# EAGLE schematic PCB-for-IoT-sch (EAGLE 9.7.0)
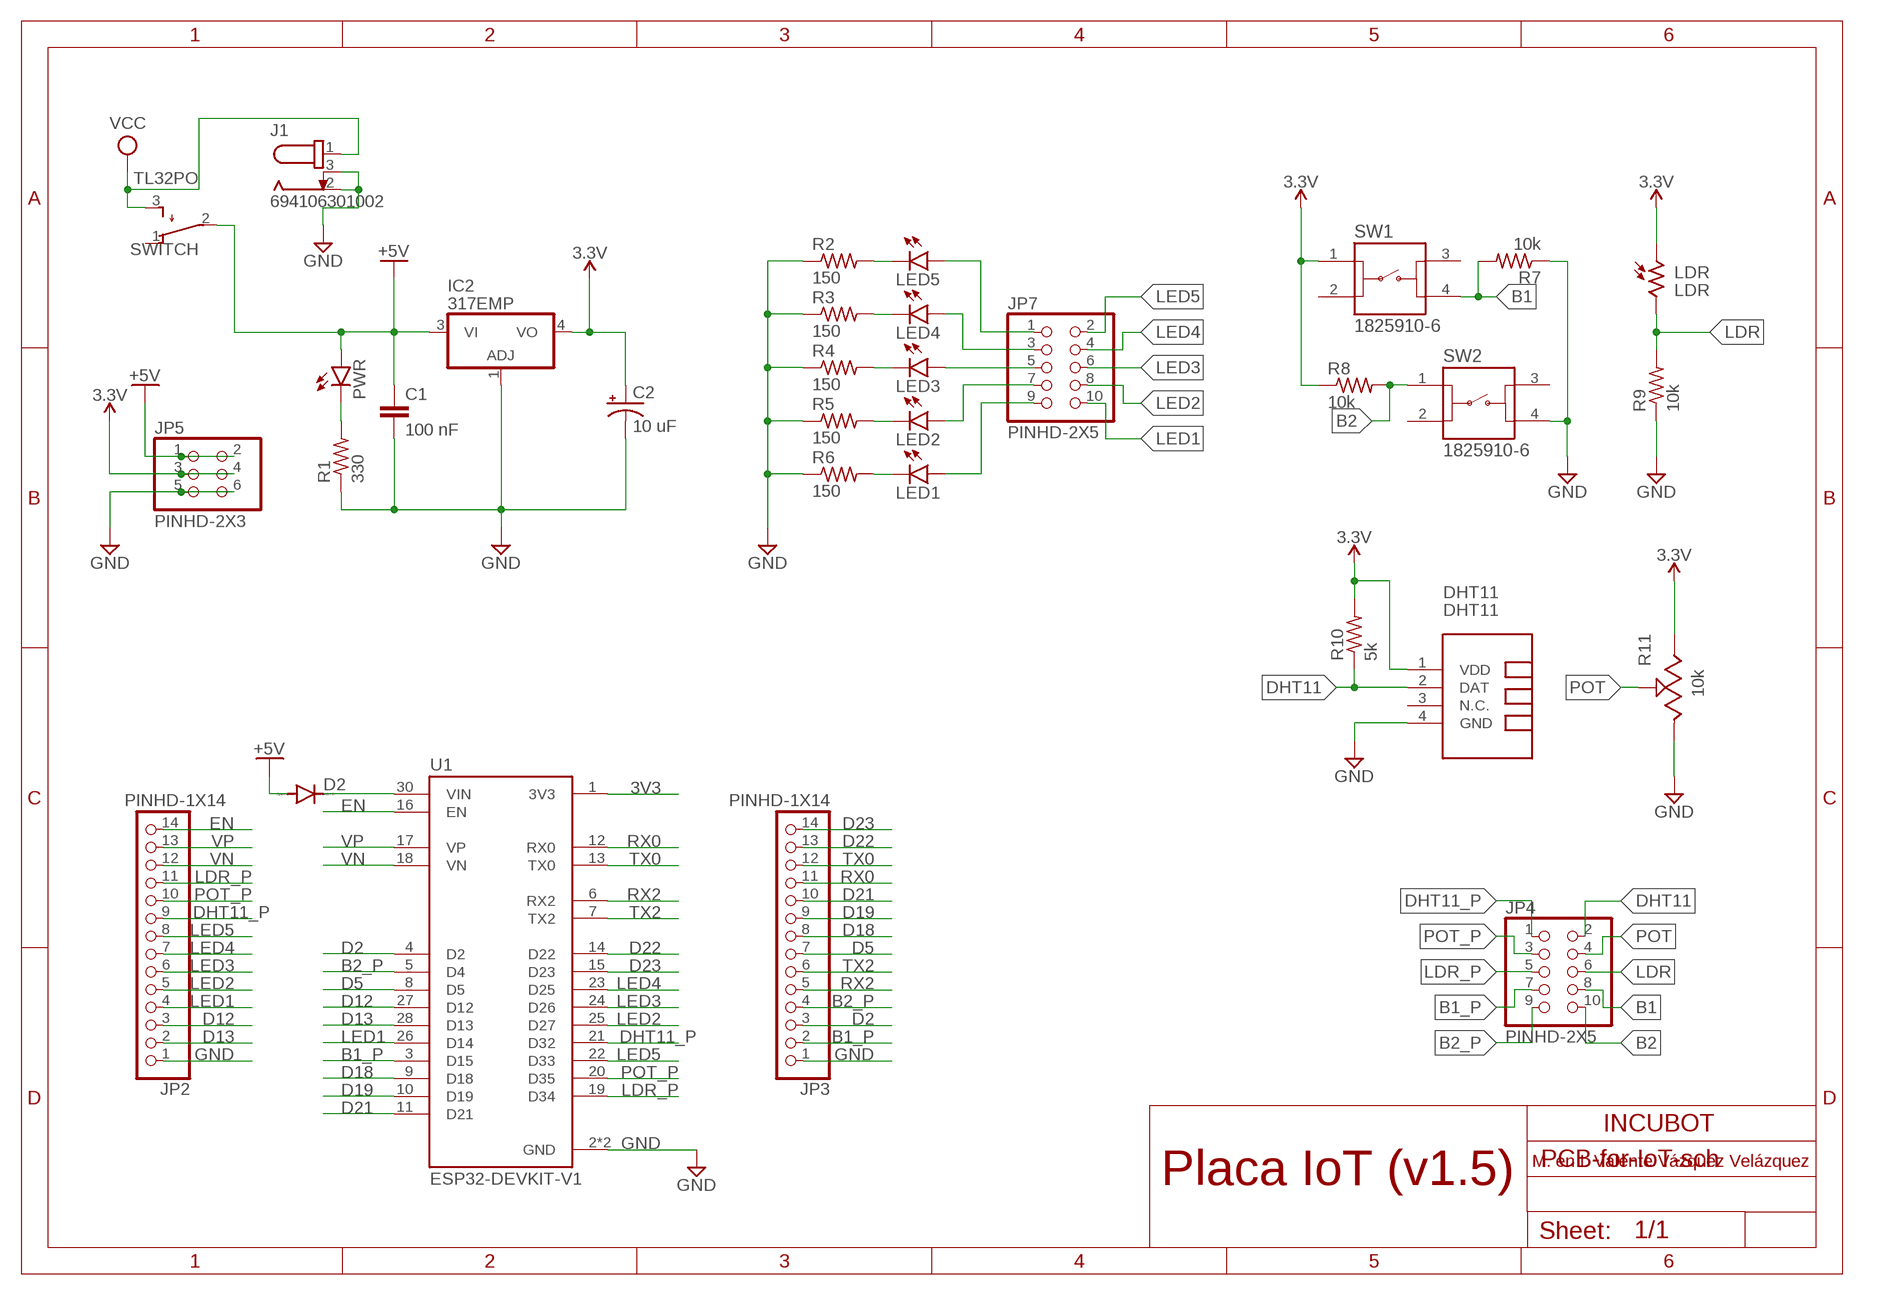
[diagram p0: schematic, sheet 1]

## Parts
C1  100 nF  C-EU050-025X075  [C050-025X075]
C2  10 uF  CPOL-USE2-4  [E2-4]
D2  1N4148DO35-7  [DO35-7]
DHT11  DHT11  TEMP-HUM-SENSOR-DHT11  [TEMP-HUM-SENSOR-DHT11]
IC2  317EMP  [SOT223]
J1  694106301002  [694106301002]
JP2  PINHD-1X14  [1X14]
JP3  PINHD-1X14  [1X14]
JP4  PINHD-2X5  [2X05]
JP5  PINHD-2X3  [2X03]
JP7  PINHD-2X5  [2X05]
LDR  LDR  NSL-19M51-TO-18_PLASTIC  [NSL_PT_TO-18_PLASTIC]
LED1  LED3MM  [LED3MM]
LED2  LED3MM  [LED3MM]
LED3  LED3MM  [LED3MM]
LED4  LED3MM  [LED3MM]
LED5  LED3MM  [LED3MM]
PWR  LED3MM  [LED3MM]
R1  330  R-US_0207/10  [0207/10]
R2  150  R-US_0207/10  [0207/10]
R3  150  R-US_0207/10  [0207/10]
R4  150  R-US_0207/10  [0207/10]
R5  150  R-US_0207/10  [0207/10]
R6  150  R-US_0207/10  [0207/10]
R7  10k  R-US_0207/10  [0207/10]
R8  10k  R-US_0207/10  [0207/10]
R9  10k  R-US_0207/10  [0207/10]
R10  5k  R-US_0207/10  [0207/10]
R11  10k  3362P-1-103LF  [3362P-1-103LF]
SW1  1825910-6  [1825910-6]
SW2  1825910-6  [1825910-6]
SWITCH  TL32PO  [TL3XPO]
U1  ESP32-DEVKIT-V1  [MODULE_ESP32_DEVKIT_V1]

## Nets
3.3V: C2.+ DHT11.1(VDD) IC2.4(VO) JP5.3 JP5.4 LDR.1 R8.1 R10.2 R11.3 SW1.1
3V3: U1.1(3V3)
+5V: C1.1 D2.A IC2.3(VI) JP5.1 JP5.2 PWR.A SWITCH.2(P)
B1: JP4.8 R7.2 SW1.4
B1_P: JP3.2 JP4.7 U1.3(D15)
B2: JP4.10 R8.2 SW2.1
B2_P: JP3.4 JP4.9 U1.5(D4)
D2: JP3.3 U1.4(D2)
D5: JP3.7 U1.8(D5)
D12: JP2.3 U1.27(D12)
D13: JP2.2 U1.28(D13)
D18: JP3.8 U1.9(D18)
D19: JP3.9 U1.10(D19)
D21: JP3.10 U1.11(D21)
D22: JP3.13 U1.14(D22)
D23: JP3.14 U1.15(D23)
DHT11: DHT11.2(DAT) JP4.2 R10.1
DHT11_P: JP2.9 JP4.1 U1.21(D32)
EN: JP2.14 U1.16(EN)
GND: C1.2 C2.- DHT11.4(GND) IC2.1(ADJ) J1.2 J1.3 JP2.1 JP3.1 JP5.5 JP5.6 R1.1 R2.1 R3.1 R4.1 R5.1 R6.1 R7.1 R9.1 R11.1 SW2.4 U1.2(GND) U1.29(GND)
LDR: JP4.6 LDR.2 R9.2
LDR_P: JP2.11 JP4.5 U1.19(D34)
LED1: JP2.4 JP7.10 U1.26(D14)
LED2: JP2.5 JP7.8 U1.25(D27)
LED3: JP2.6 JP7.6 U1.24(D26)
LED4: JP2.7 JP7.4 U1.23(D25)
LED5: JP2.8 JP7.2 U1.22(D33)
N$1: PWR.K(C) R1.2
N$2: LED5.K(C) R2.2
N$3: LED4.K(C) R3.2
N$4: LED3.K(C) R4.2
N$5: LED2.K(C) R5.2
N$6: LED1.K(C) R6.2
N$7: JP7.5 LED3.A
N$8: JP7.3 LED4.A
N$9: JP7.7 LED2.A
N$10: JP7.1 LED5.A
N$11: JP7.9 LED1.A
N$12: D2.C U1.30(VIN)
POT: JP4.4 R11.2
POT_P: JP2.10 JP4.3 U1.20(D35)
RX0: JP3.11 U1.12(RX0)
RX2: JP3.5 U1.6(RX2)
TX0: JP3.12 U1.13(TX0)
TX2: JP3.6 U1.7(TX2)
VCC: J1.1 SWITCH.3(S)
VN: JP2.12 U1.18(VN)
VP: JP2.13 U1.17(VP)
Unconnected: DHT11.3(N.C.) SW1.2 SW1.3 SW2.2 SW2.3 SWITCH.1(O)

## Notes on the sheet
- INCUBOT
- Placa IoT (v1.5)
- M. en I. Valente Vázquez Velázquez

## Library data of the parts
C1 = rcl:C-EU: CAPACITOR, European symbol; SPICEPREFIX: C
C2 = rcl:CPOL-US: POLARIZED CAPACITOR, American symbol; SPICEPREFIX: C
D2 = diode:1N4148: DIODE high speed (Philips)
DHT11 = DHT11:TEMP-HUM-SENSOR-DHT11: DHT11 - digital humidity & temperature sensor DHT11 datasheet available here: https://akizukidenshi.com/download/ds/aosong/DHT11.pdf Click here to find device on ebay.com <http://www.ebay.com/sch/dht11+digital+sensor>
IC2 = linear:*317: Positive VOLTAGE REGULATOR
J1 = DC Power Jacks:694106301002: CONN PWR JACK 2.1X5.5MM SOLDER Manufacturer's datasheet <https://katalog.we-online.de/em/datasheet/6941xx301002.pdf>; CREATED_BY: PCBLayout.com; DIGIKEY_PART_NUMBER: 732-5930-ND; MANUFACTURER: Wurth Electronics Inc.; MPN: 694106301002
JP2 JP3 = Connector:PINHD-1X14: PIN HEADER; CATEGORY: CONNECTOR; SUB-CATEGORY: PIN-HEADER
JP4 JP7 = Connector:PINHD-2X5: PIN HEADER; CATEGORY: CONNECTOR; SUB-CATEGORY: PIN-HEADER
JP5 = Connector:PINHD-2X3: PIN HEADER; CATEGORY: CONNECTOR; SUB-CATEGORY: PIN-HEADER
LDR = Sensor:NSL-*-: Hermetic Photocell Datasheet <https://media.digikey.com/pdf/Data%20Sheets/Photonic%20Detetectors%20Inc%20PDFs/NSL-5510.pdf> Datasheet <https://media.digikey.com/pdf/Data%20Sheets/Photonic%20Detetectors%20Inc%20PDFs/Hermetic%20Pkg'd%20CdS%20Product%20Overview.pdf>; CATEGORY: Sensor; DESCRIPTION: PHOTOCELL; MPN: NSL-19M51; OPERATING_TEMP: -60°C to 75°C; PART_STATUS: Active; ROHS_COMPLIANT: Non-Compliant; SERIES: -; SUB-CATEGORY: Photocell; VALUE: NSL-19M51
LED1-LED5 PWR = led:LED: LED OSRAM: - CHIPLED LG R971, LG N971, LY N971, LG Q971, LY Q971, LO R971, LY R971 LH N974, LH R974 LS Q976, LO Q976, LY Q976 LO Q996 - Hyper CHIPLED LW Q18S LB Q993, LB Q99A, LB R99A - SideLED LS A670, LO A670, LY A670, LG A670, LP A670 LB A673, LV A673, LT A673, LW A673 LH A674 LY A675 LS A676, LA A676, LO A676, LY A676, LW A676 LS A679, LY A679, LG A679 - Hyper Micro SIDELED® LS Y876, LA Y876, LO Y876, LY Y876 LT Y87S - SmartLED LW L88C, LW L88S LB L89C, LB L89S, LG L890 LS L89K, LO L89K, LY L89K LS L896, LA L896, LO L896, LY L896 - TOPLED LS T670, LO T670, LY T670, LG T670, LP T670 LSG T670, LSP T670, LSY T670, LOP T670, LYG T670 LG T671, LOG T671, LSG T671 LB T673, LV T673, LT T673, LW T673 LH T674 LS T676, LA T676, LO T676, LY T676, LB T676, LH T676, LSB T676, LW T676 LB T67C, LV T67C, LT T67C, LS T67K, LO T67K, LY T67K, LW E67C LS E67B, LA E67B, LO E67B, LY E67B, LB E67C, LV E67C, LT E67C LW T67C LS T679, LY T679, LG T679 LS T770, LO T770, LY T770, LG T770, LP T770 LB T773, LV T773, LT T773, LW T773 LH T774 LS E675, LA E675, LY E675, LS T675 LS T776, LA T776, LO T776, LY T776, LB T776 LHGB T686 LT T68C, LB T68C - Hyper Mini TOPLED® LB M676 - Mini TOPLED Santana® LG M470 LS M47K, LO M47K, LY M47K Source: http://www.osram.convergy.de LUXEON: - LUMILED® LXK2-PW12-R00, LXK2-PW12-S00, LXK2-PW14-U00, LXK2-PW14-V00 LXK2-PM12-R00, LXK2-PM12-S00, LXK2-PM14-U00 LXK2-PE12-Q00, LXK2-PE12-R00, LXK2-PE12-S00, LXK2-PE14-T00, LXK2-PE14-U00 LXK2-PB12-K00, LXK2-PB12-L00, LXK2-PB12-M00, LXK2-PB14-N00, LXK2-PB14-P00, LXK2-PB14-Q00 LXK2-PR12-L00, LXK2-PR12-M00, LXK2-PR14-Q00, LXK2-PR14-R00 LXK2-PD12-Q00, LXK2-PD12-R00, LXK2-PD12-S00 LXK2-PH12-R00, LXK2-PH12-S00 LXK2-PL12-P00, LXK2-PL12-Q00, LXK2-PL12-R00 Source: www.luxeon.com KINGBRIGHT: KA-3528ASYC Source: www.kingbright.com
R1-R10 = rcl:R-US_: RESISTOR, American symbol; SPICEPREFIX: R
R11 = Potentiometer_Trimmers:3362P-1-103LF: TRIMMER 10K OHM 0.5W PC PIN TOP Manufacturer's datasheet <https://www.bourns.com/docs/Product-Datasheets/3362.pdf>; CREATED_PN: PCBLayout.com; DIGIKEY_PN: 3362P-103LF-ND; MANUFACTURER: Bourns Inc.; MPN: 3362P-1-103LF
SW1 SW2 = Switch:1825910-6: SWITCH TACTILE SPST-NO 0.05A 24V Manufacturer's datasheet <https://www.te.com/commerce/DocumentDelivery/DDEController?Action=srchrtrv&DocNm=1825910&DocType=Customer+Drawing&DocLang=English>; CREATED_BY: PCBLayout.com; DIGIKEY_PART_NUMBER: 450-1650-ND; MANUFACTURER: TE Connectivity ALCOSWITCH Switches; MPN: 1825910-6
SWITCH = switch:TL32PO: TINY SWITCH ON - MOM Source: http://www2.produktinfo.conrad.com/datenblaetter/700000-724999/705152-da-01-de-Subminiaturschalter_TL_36YO.pdf
U1 = ESP32-DEVKIT-V1:ESP32-DEVKIT-V1: Dual core, Wi-Fi: 2.4 GHz up to 150 Mbits/s,BLE (Bluetooth Low Energy) and legacy Bluetooth, 32 bits, Up to 240 MHz; MANUFACTURER: DOIT; MAXIMUM_PACKAGE_HEIGHT: 6.8 mm; PARTREV: N/A; STANDARD: Manufacturer Recommendations